# EAGLE design PCB-DISPLAYDOGM2 (EAGLE 7.7.0)

## Sheet 1 of 2
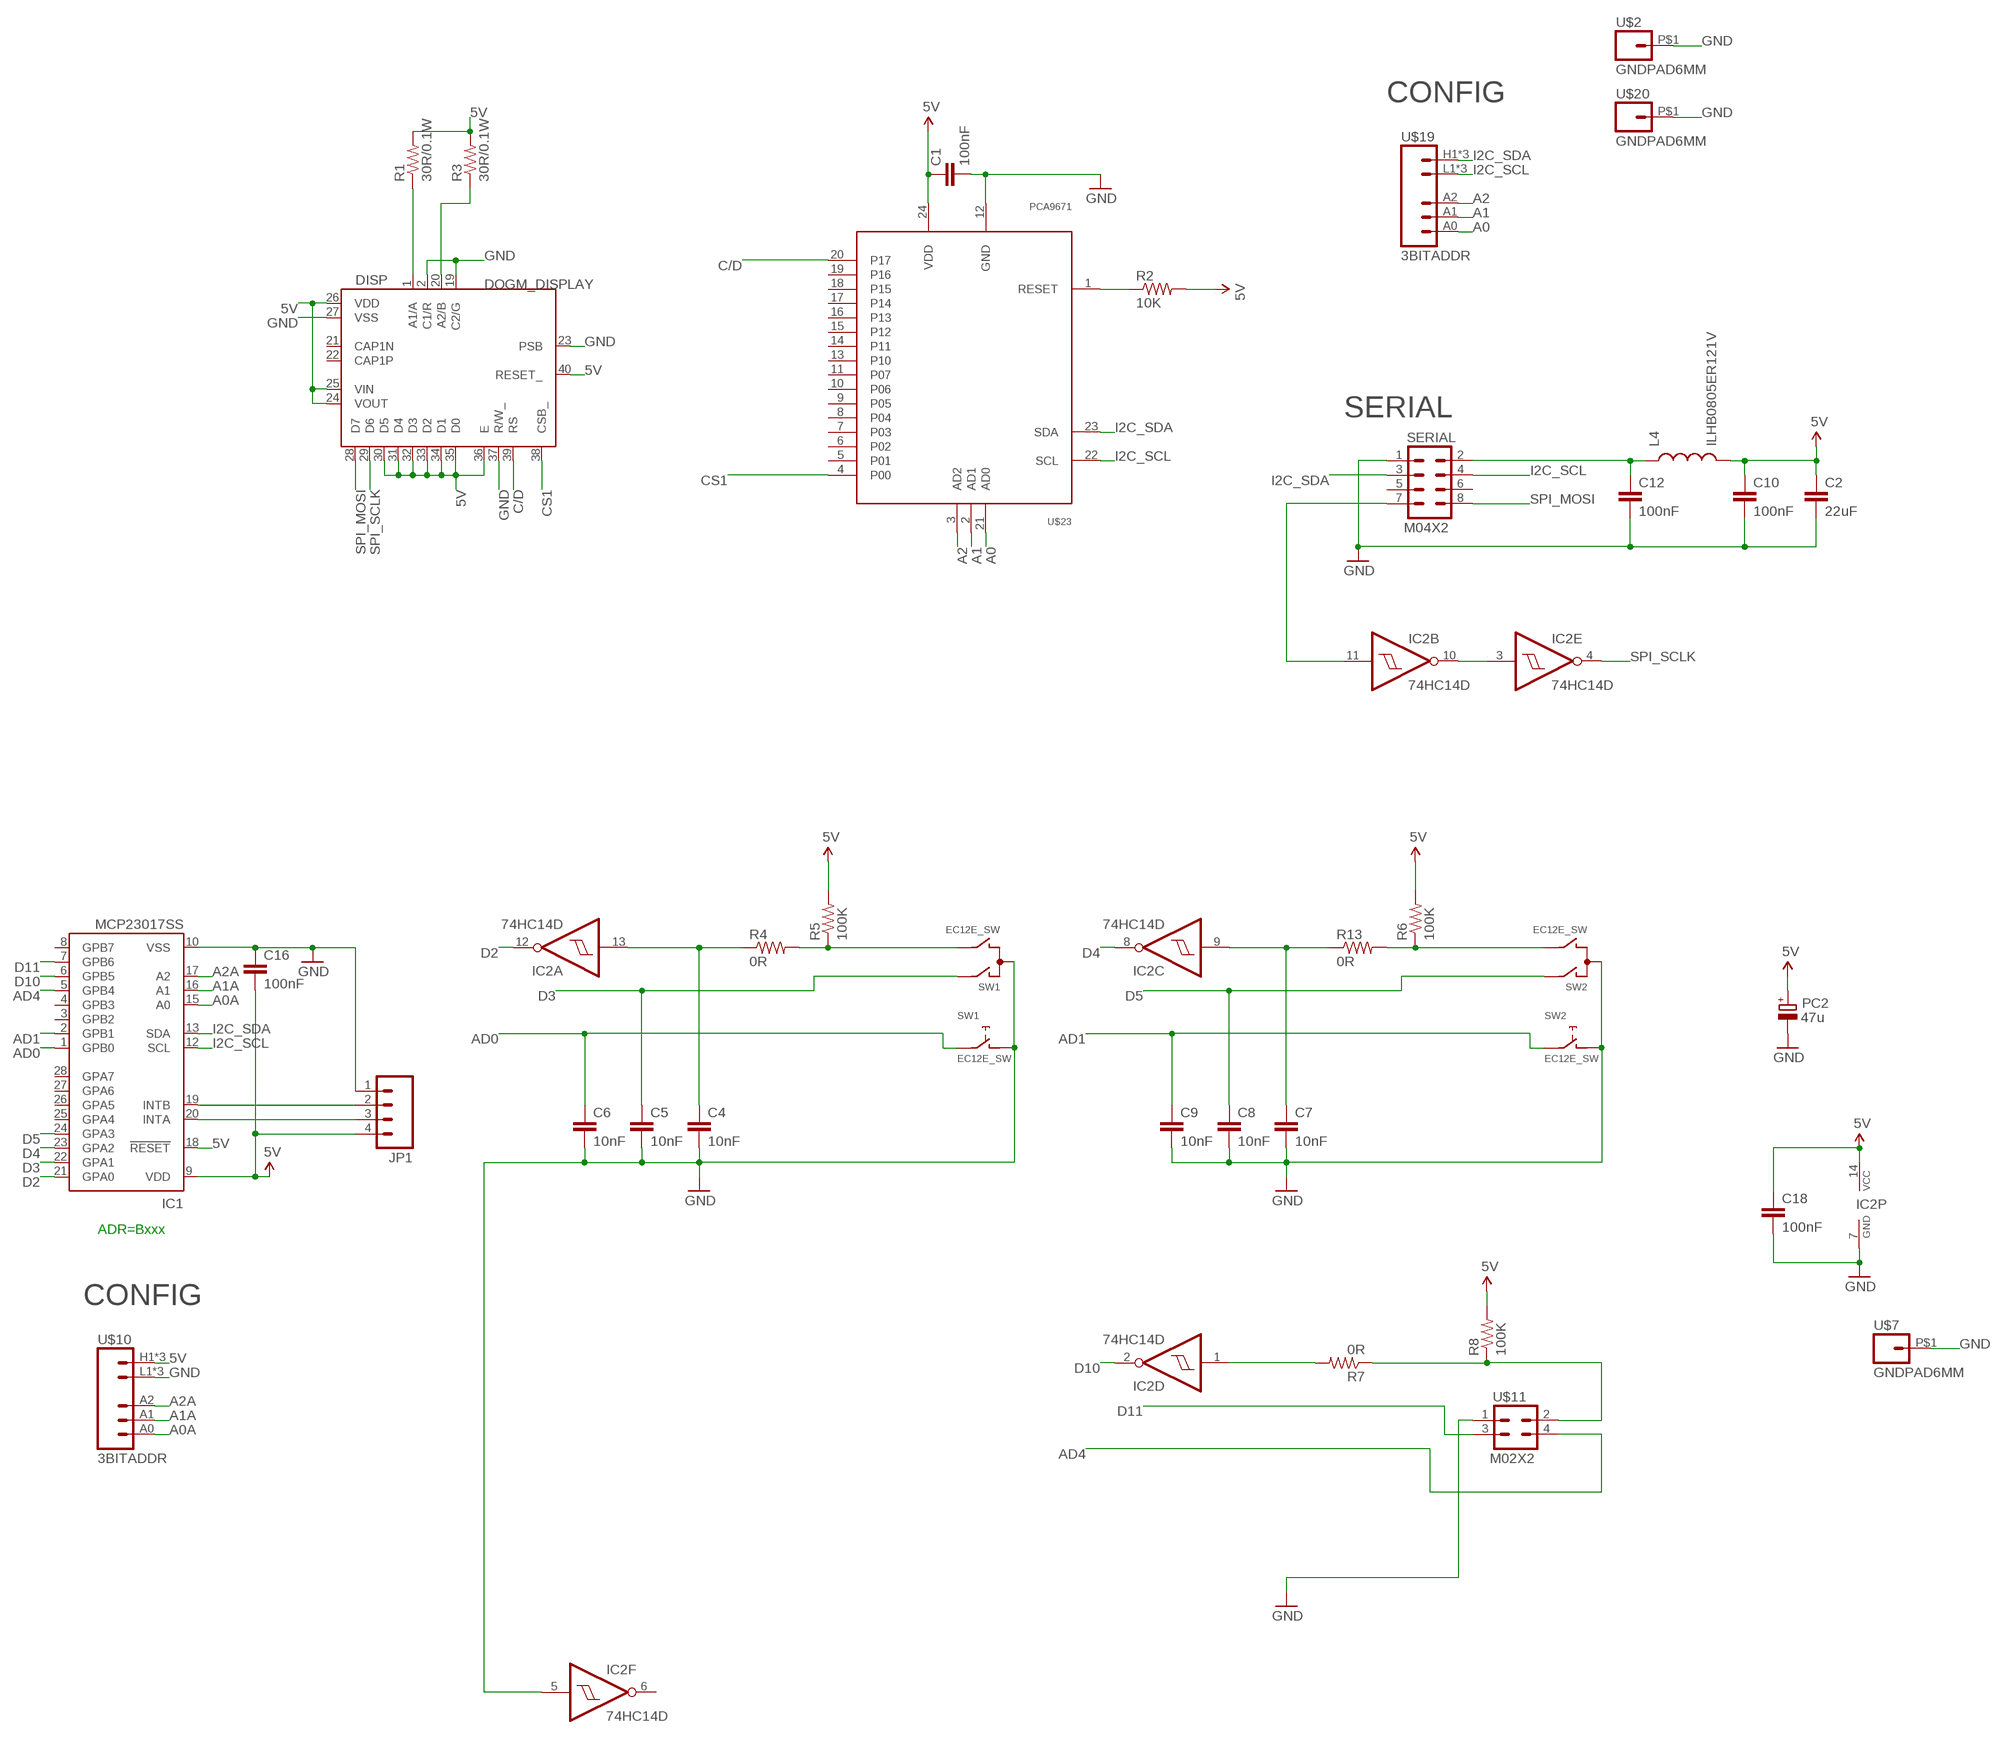
[diagram p0: schematic, sheet 1]

### Parts
C1  100nF  CAP0603-CAP  [0603-CAP]
C2  22uF  CAP0805  [0805]
C4  10nF  CAP0603-CAP  [0603-CAP]
C5  10nF  CAP0603-CAP  [0603-CAP]
C6  10nF  CAP0603-CAP  [0603-CAP]
C7  10nF  CAP0603-CAP  [0603-CAP]
C8  10nF  CAP0603-CAP  [0603-CAP]
C9  10nF  CAP0603-CAP  [0603-CAP]
C10  100nF  CAP0603-CAP  [0603-CAP]
C12  100nF  CAP0603-CAP  [0603-CAP]
C16  100nF  CAP0603-CAP  [0603-CAP]
C18  100nF  CAP0603-CAP  [0603-CAP]
DISP  DOGM_DISPLAY  [DOGM]
IC1  MCP23017SS  [SSOP28]
IC2  74HC14D  [SO14]
JP1  M04PTH  [1X04]
L4  ILHB0805ER121V  INDUCTOR0805  [0805]
PC2  47u  CPOL-EUD  [PANASONIC_D]
R1  30R/0.1W  RESISTOR0603-RES  [0603-RES]
R2  10K  RESISTOR0603-RES  [0603-RES]
R3  30R/0.1W  RESISTOR0603-RES  [0603-RES]
R4  0R  RESISTOR0603-RES  [0603-RES]
R5  100K  RESISTOR0603-RES  [0603-RES]
R6  100K  RESISTOR0603-RES  [0603-RES]
R7  0R  RESISTOR0603-RES  [0603-RES]
R8  100K  RESISTOR0603-RES  [0603-RES]
R13  0R  RESISTOR0603-RES  [0603-RES]
SERIAL  M04X2  [2X4]
SW1  EC12E_SW  [ALPS_EC12E_SW]
SW2  EC12E_SW  [ALPS_EC12E_SW]
U$2  GNDPAD6MM  [3.2MMPAD6MM]
U$7  GNDPAD6MM  [3.2MMPAD6MM]
U$10  3BITADDR  [3BITADDR]
U$11  M02X2  [2X2]
U$19  3BITADDR  [3BITADDR]
U$20  GNDPAD6MM  [3.2MMPAD6MM]
U$23  PCA9671  [TSSOP24]

### Nets
5V [Power]: C1.1 C2.1 C10.1 C16.2 C18.1 DISP.24(VOUT) DISP.25(VIN) DISP.26(VDD) DISP.30(D5) DISP.31(D4) DISP.32(D3) DISP.33(D2) DISP.34(D1) DISP.35(D0) DISP.36(E) DISP.40(RESET_) IC1.9(VDD) IC1.18(!RESET) IC2.14(P:VCC) JP1.4 L4.2 PC2.+ R1.2 R2.2 R3.2 R5.2 R6.2 R8.2 U$10.H1(VCC) U$10.H2(VCC) U$10.H3(VCC) U$23.24(VDD)
A0: U$19.A0 U$23.21(AD0)
A0A: IC1.15(A0) U$10.A0
A1: U$19.A1 U$23.2(AD1)
A1A: IC1.16(A1) U$10.A1
A2: U$19.A2 U$23.3(AD2)
A2A: IC1.17(A2) U$10.A2
AD0: C6.1 IC1.1(GPB0) SW1.E
AD1: C9.1 IC1.2(GPB1) SW2.E
AD4: IC1.5(GPB4) U$11.4
ARD_5V [Power]: C12.1 L4.1 SERIAL.2
C/D: DISP.39(RS) U$23.20(P17)
CS1: DISP.38(CSB_) U$23.4(P00)
D2: IC1.21(GPA0) IC2.12(A:O)
D3: C5.1 IC1.22(GPA1) SW1.A
D4: IC1.23(GPA2) IC2.8(C:O)
D5: C8.1 IC1.24(GPA3) SW2.A
D10: IC1.6(GPB5) IC2.2(D:O)
D11: IC1.7(GPB6) U$11.3
GND [Power]: C1.2 C2.2 C4.2 C5.2 C6.2 C7.2 C8.2 C9.2 C10.2 C12.2 C16.1 C18.2 DISP.2(C1/R) DISP.19(C2/G) DISP.23(PSB) DISP.27(VSS) DISP.37(R/W_) IC1.10(VSS) IC2.5(F:I) IC2.7(P:GND) JP1.1 PC2.- SERIAL.1 SW1.C SW1.D SW2.C SW2.D U$2.P$1 U$7.P$1 U$10.L1(GND) U$10.L2(GND) U$10.L3(GND) U$11.1 U$20.P$1 U$23.12(GND)
I2C_SCL: IC1.12(SCL) SERIAL.4 U$19.L1(GND) U$19.L2(GND) U$19.L3(GND) U$23.22(SCL)
I2C_SDA: IC1.13(SDA) SERIAL.3 U$19.H1(VCC) U$19.H2(VCC) U$19.H3(VCC) U$23.23(SDA)
N$1: R2.1 U$23.1(RESET)
N$2: DISP.1(A1/A) R1.1
N$3: DISP.20(A2/B) R3.1
N$4: R4.2 R5.1 SW1.B
N$5: IC2.1(D:I) R7.2
N$6: R6.1 R13.2 SW2.B
N$7: IC2.3(E:I) IC2.10(B:O)
N$8: IC2.11(B:I) SERIAL.7
N$17: IC1.19(INTB) JP1.2
N$18: IC1.20(INTA) JP1.3
N$124: C4.1 IC2.13(A:I) R4.1
N$125: C7.1 IC2.9(C:I) R13.1
N$127: R7.1 R8.1 U$11.2
SPI_MOSI: DISP.28(D7) SERIAL.8
SPI_SCLK: DISP.29(D6) IC2.4(E:O)
Unconnected: DISP.21(CAP1N) DISP.22(CAP1P) IC1.3(GPB2) IC1.4(GPB3) IC1.8(GPB7) IC1.25(GPA4) IC1.26(GPA5) IC1.27(GPA6) IC1.28(GPA7) IC2.6(F:O) SERIAL.5 SERIAL.6 SW1.GND1(G) SW1.GND2(G) SW2.GND1(G) SW2.GND2(G) U$23.5(P01) U$23.6(P02) U$23.7(P03) U$23.8(P04) U$23.9(P05) U$23.10(P06) U$23.11(P07) U$23.13(P10) U$23.14(P11) U$23.15(P12) U$23.16(P13) U$23.17(P14) U$23.18(P15) U$23.19(P16)

### Notes on the sheet
- CONFIG
- SERIAL
- ADR=Bxxx
- CONFIG

## Sheet 2 of 2

## Library data of the parts
C1 C2 C4-C10 C12 C16 C18 = SparkFun:CAP: Capacitor Standard 0603 ceramic capacitor, and 0.1" leaded capacitor.
DISP = SKAARHOJ:DOGM_DISPLAY
IC1 = microchip:MCP23017: http://ww1.microchip.com/downloads/en/DeviceDoc/21952a.pdf Source: http://ww1.microchip.com/downloads/en/DeviceDoc/21952a.pdf; MF: MICROCHIP; MPN: MCP23017-E/SS; OC_FARNELL: 1467674; OC_NEWARK: 31K2960
IC2 = 74xx-eu:74*14: Hex schmitt trigger INVERTER
JP1 = SparkFun:M04: Header 4 Standard 4-pin 0.1" header. Use with straight break away headers (SKU : PRT-00116), right angle break away headers (PRT-00553), swiss pins (PRT-00743), machine pins (PRT-00117), and female headers (PRT-00115). Molex polarized connector foot print use with SKU : PRT-08231 with associated crimp pins and housings. 1MM SMD Version SKU: PRT-10208
L4 = SparkFun:INDUCTOR: Inductors Basic Inductor/Choke - 0603 and 1206. Footprints are not proven and vary greatly between part numbers.
PC2 = rcl:CPOL-EU: POLARIZED CAPACITOR, European symbol
R1-R8 R13 = SparkFun:RESISTOR: Resistor Basic schematic elements and footprints for 0603, 1206, and PTH resistors.
SERIAL = SparkFun:M04X2
SW1 SW2 = switch-alps:EC12E_SW: ALPS rotary Encoder EC12E series with switch; MPN: EC12E2424407; OC_FARNELL: 1520813; OC_NEWARK: 74M1068
U$2 U$7 U$20 = SKAARHOJ:GNDPAD
U$10 U$19 = SKAARHOJ:3BITADDR
U$11 = SKAARHOJ:M02X2
U$23 = SKAARHOJ:PCA9671

## Net classes
0 default: width 0.203 mm, drill 0.406 mm, clearance 0.203 mm
1 Power: width 0.406 mm, drill 0.61 mm, clearance 0.203 mm
2 BoostPower: width 0.61 mm, drill 0.61 mm, clearance 0.305 mm

## Board
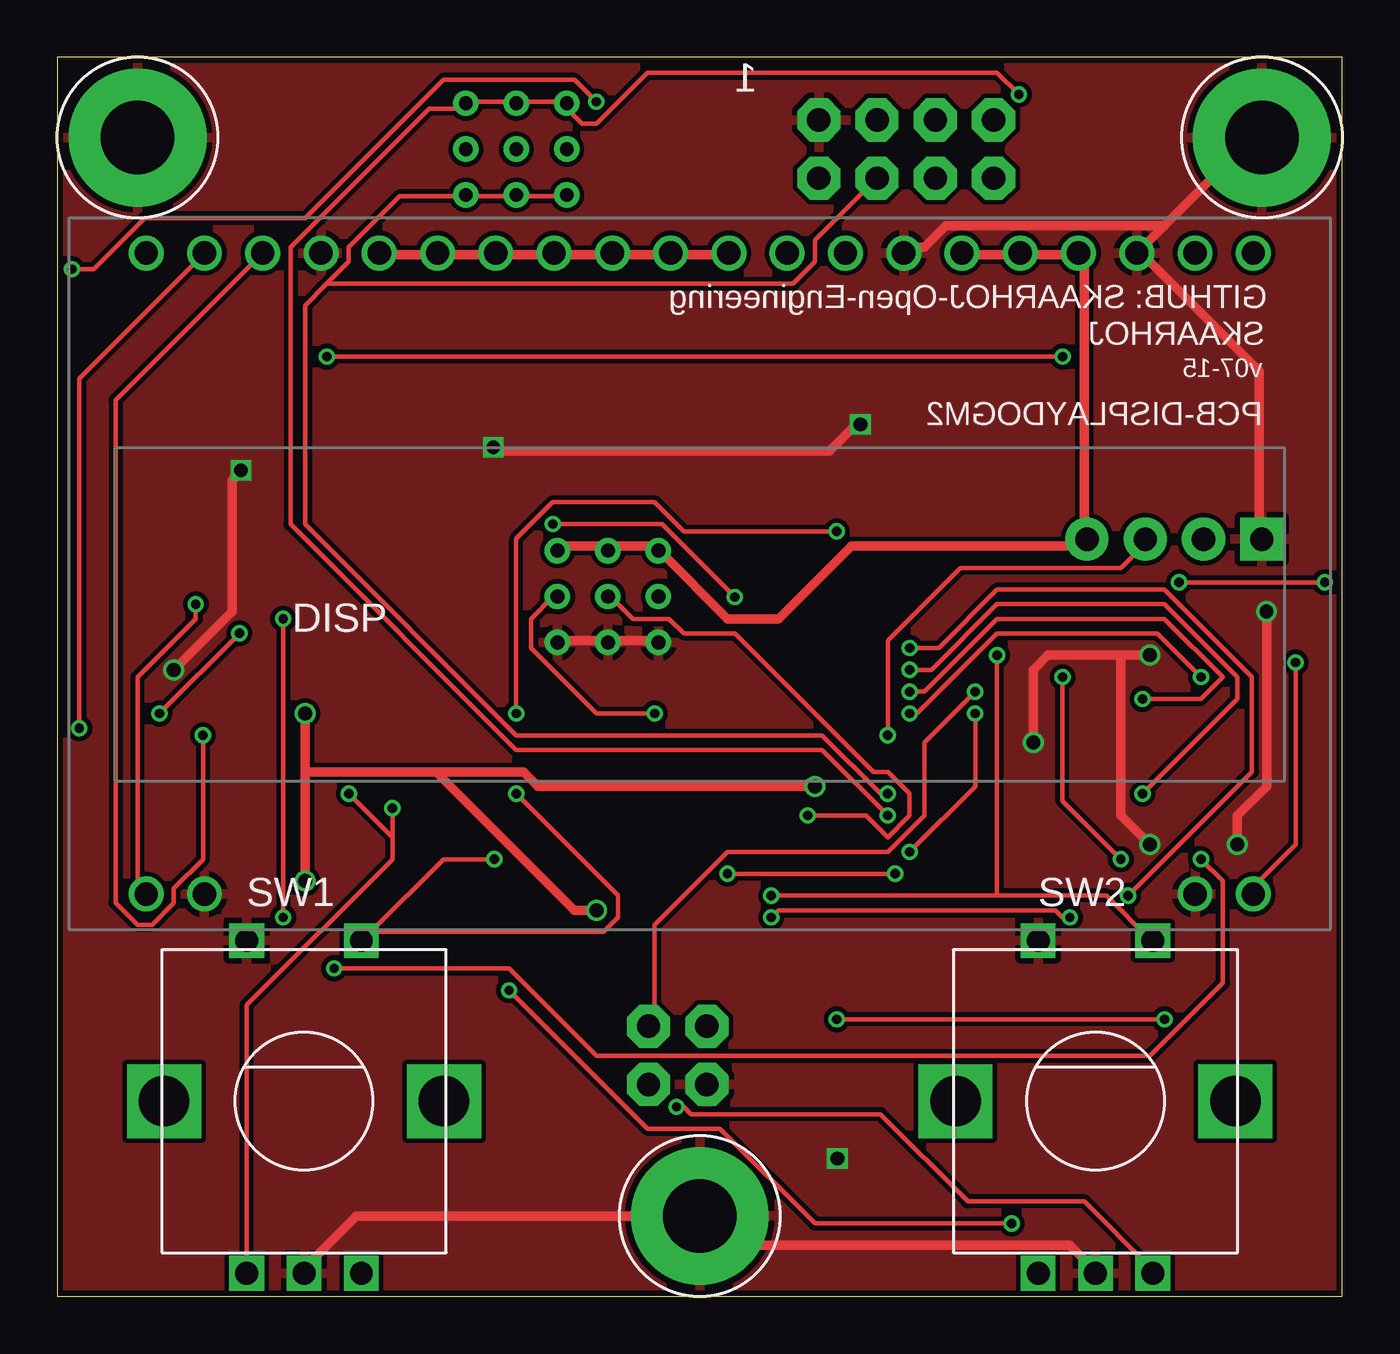
[diagram p1: board, top side]
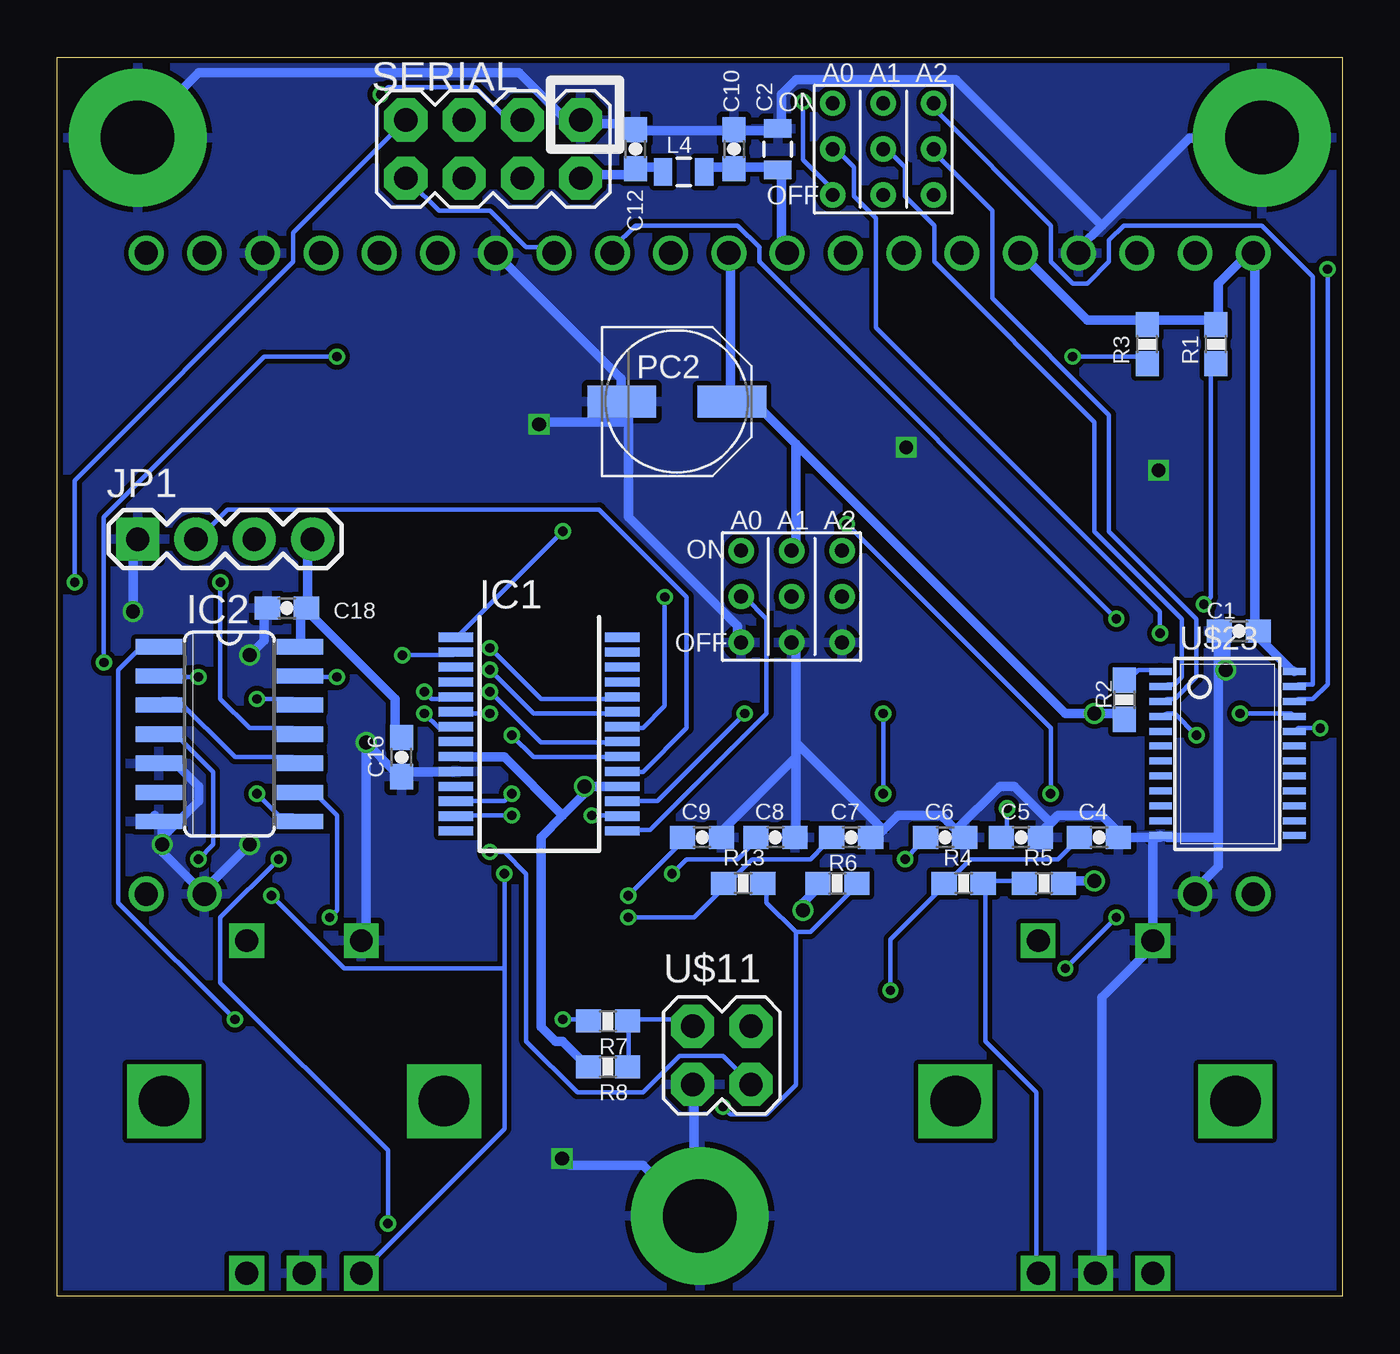
[diagram p2: board, bottom side, seen from below]

Size 56 x 54 mm. Coordinates in mm from the lower left corner, seen from the top.
Outline: 56,0 56,54 0,54 0,0 56,0
Copper layers (1*16): Top 0.035mm / dielectric 1.5mm / Bottom 0.035mm
Design rules "Fusion_eagle_rule_v1.1": minimum track width 6mil, minimum drill 12mil, track to track 6mil, track to pad 6mil, pad to pad 6mil, via to via 6mil, smd to smd 0mil, copper to edge 10mil, drill to drill 10mil, minimum pad ring 10mil, minimum via ring 6mil, stop-mask expansion 2mil, vias tented up to drill 100mil, thermal gap 10mil

### Footprints (pad centres in the part's own frame; a part is rotated, then mirrored left to right if it is on the bottom)
0603-CAP = smd 1.1 x 1: 1 -0.85,0; 2 0.85,0
0805 = smd 0.8 x 1.2: 1 -0.9,0; 2 0.9,0
DOGM = drill 1.016: 1 -24.13,-12.19; 2 -21.59,-12.19; 19 21.59,-12.19; 20 24.13,-12.19; 21 24.13,15.75; 22 21.59,15.75; 23 19.05,15.75; 24 16.51,15.75; 25 13.97,15.75; 26 11.43,15.75; 27 8.89,15.75; 28 6.35,15.75; 29 3.81,15.75; 30 1.27,15.75; 31 -1.27,15.75; 32 -3.81,15.75; 33 -6.35,15.75; 34 -8.89,15.75; 35 -11.43,15.75; 36 -13.97,15.75; 37 -16.51,15.75; 38 -19.05,15.75; 39 -21.59,15.75; 40 -24.13,15.75
SSOP28 = smd 0.4 x 1.5: 1 -4.225,-3.625; 2 -3.575,-3.625; 3 -2.925,-3.625; 4 -2.275,-3.625; 5 -1.625,-3.625; 6 -0.975,-3.625; 7 -0.325,-3.625; 8 0.325,-3.625; 9 0.975,-3.625; 10 1.625,-3.625; 11 2.275,-3.625; 12 2.925,-3.625; 13 3.575,-3.625; 14 4.225,-3.625; 15 4.225,3.625; 16 3.575,3.625; 17 2.925,3.625; 18 2.275,3.625; 19 1.625,3.625; 20 0.975,3.625; 21 0.325,3.625; 22 -0.325,3.625; 23 -0.975,3.625; 24 -1.625,3.625; 25 -2.275,3.625; 26 -2.925,3.625; 27 -3.575,3.625; 28 -4.225,3.625
SO14 = smd 0.66 x 2.032: 1 -3.81,-3.073; 2 -2.54,-3.073; 3 -1.27,-3.073; 4 0,-3.073; 5 1.27,-3.073; 6 2.54,-3.073; 7 3.81,-3.073; 8 3.81,3.073; 9 2.54,3.073; 10 1.27,3.073; 11 0,3.073; 12 -1.27,3.073; 13 -2.54,3.073; 14 -3.81,3.073
1X04 = drill 1.016 pad 1.88 square: 1 0,0 | drill 1.016 pad 1.88: 2 2.54,0; 3 5.08,0; 4 7.62,0
PANASONIC_D = smd 3 x 1.4: + 2.4,0; - -2.4,0
0603-RES = smd 1.1 x 1: 1 -0.85,0; 2 0.85,0
2X4 = drill 1.016 pad 1.88 octagon: 1 -3.81,-1.27; 2 -3.81,1.27; 3 -1.27,-1.27; 4 -1.27,1.27; 5 1.27,-1.27; 6 1.27,1.27; 7 3.81,-1.27; 8 3.81,1.27
ALPS_EC12E_SW = drill 1 square: A -2.5,-7.5; B 2.5,-7.5; C 0,-7.5; D -2.5,7; E 2.5,7 | drill 2.2 square: GND1 -6.1,0; GND2 6.1,0
3.2MMPAD6MM = drill 3.2 pad 6: P$1 0,0
3BITADDR = drill 0.6: A0 -2.2,0; A1 0,0; A2 2.2,0; H1 -2.2,2; H2 0,2; H3 2.2,2; L1 -2.2,-2; L2 0,-2; L3 2.2,-2
2X2 = drill 1.016 pad 1.88 octagon: 1 -3.81,-1.27; 2 -3.81,1.27; 3 -1.27,-1.27; 4 -1.27,1.27
TSSOP24 = smd 0.305 x 0.991: 1 -4.225,-2.918; 2 -3.575,-2.918; 3 -2.925,-2.918; 4 -2.275,-2.918; 5 -1.625,-2.918; 6 -0.975,-2.918; 7 -0.325,-2.918; 8 0.325,-2.918; 9 0.975,-2.918; 10 1.625,-2.918; 11 2.275,-2.918; 12 2.925,-2.918; 13 2.925,2.918; 14 2.275,2.918; 15 1.625,2.918; 16 0.975,2.918; 17 0.325,2.918; 18 -0.325,2.918; 19 -0.975,2.918; 20 -1.625,2.918; 21 -2.275,2.918; 22 -2.925,2.918; 23 -3.575,2.918; 24 -4.225,2.918

### Placement (x,y rotation side)
C1  4.5,29 180 bottom
C2  24.6,50 90 bottom
C4  10.6,20 0 bottom
C5  14,20 0 bottom
C6  17.3,20 0 bottom
C7  21.4,20 0 bottom
C8  24.7,20 0 bottom
C9  27.9,20 0 bottom
C10  26.5,50 90 bottom
C12  30.8,50 90 bottom
C16  41,23.5 90 bottom
C18  46,30 180 bottom
DISP  28,29.72 0 top
IC1  35,24.5 270 bottom
IC2  48.5,24.5 270 bottom
JP1  52.5,33 0 bottom
L4  28.7,49 0 bottom
PC2  29,39 0 bottom
R1  5.5,41.5 90 bottom
R2  9.5,26 270 bottom
R3  8.5,41.5 90 bottom
R4  16.5,18 0 bottom
R5  13,18 0 bottom
R6  22,18 180 bottom
R7  32,12 180 bottom
R8  32,10 180 bottom
R13  26.1,18 0 bottom
SERIAL  37,50 180 bottom
SW1  10.75,8.5 0 top
SW2  45.25,8.5 0 top
U$2  28,3.5 0 top
U$7  52.5,50.5 0 top
U$10  24,30.5 0 bottom
U$11  24.5,10.5 0 bottom
U$19  20,50 0 bottom
U$20  3.5,50.5 0 top
U$23  5,23 270 bottom

### Tracks (layer width: path | path; a pad name or v marks a point on that pad's centre or on a via)
5V  (via drill 0.61)
  Top 0.406: DISP.26 39.69,45.4 41.91,45.4 DISP.25 42.23,45.4 44.45,45.4 DISP.24 44.77,45.4 44.77,33.02 JP1.4 44.77,32.7 34.61,32.7 31.43,29.53 29.21,29.53 26.35,32.38 U$10.H1 26.04,32.7 24.13,32.7 U$10.H2 23.81,32.7 21.91,32.7 U$10.H3 | DISP.30 29.21,45.4 26.99,45.4 DISP.31 26.67,45.4 24.45,45.4 DISP.32 24.13,45.4 21.91,45.4 DISP.33 21.59,45.4 19.37,45.4 DISP.34 19.05,45.4 16.83,45.4 DISP.35 16.51,45.4 14.29,45.4 DISP.36 | v10.79,25.4 10.79,22.86 | 10.79,22.86 v10.79,18.1 | v23.5,16.83 22.54,16.83 16.51,22.86 | 10.79,22.86 16.51,22.86 | v33.02,22.23 20.95,22.23 20.32,22.86 16.51,22.86
  Bottom 0.406: C16.2 41.27,24.45 41.27,26.04 45.09,29.84 C18.1 | IC2.14 45.4,28.57 45.4,29.84 C18.1 | JP1.4 45.09,32.7 45.09,30.16 C18.1 | U$23.24 2.22,27.3 3.81,28.89 C1.1 3.81,29.21 3.81,45.4 DISP.40 4.13,45.4 5.4,44.13 5.4,42.55 R1.2 5.71,42.55 8.26,42.55 R3.2 8.57,42.55 11.11,42.55 13.97,45.4 DISP.36 | L4.2 27.62,49.21 26.67,49.21 C10.1 26.35,49.21 24.77,49.21 C2.1 24.45,48.9 24.45,45.72 DISP.32 | 33.02,21.91 32.7,22.23 IC1.18 | 33.02,21.91 33.97,20.95 | 33.97,20.95 34.92,20 34.92,11.75 34.29,11.11 33.97,11.11 33.02,10.16 R8.2 | 33.97,20.95 36.51,23.5 38.42,23.5 IC1.9 | 23.81,37.15 25.4,38.73 26.35,38.73 PC2.+ 26.67,39.05 26.67,45.4 DISP.31 | 23.81,37.15 12.06,25.4 v10.79,25.4 9.53,25.4 R2.2 | v10.79,18.1 12.06,18.1 R5.2 | v23.5,16.83 23.5,17.14 22.86,17.78 R6.2 | 23.81,37.15 23.81,32.7 U$10.H2 | v33.02,22.23 33.02,21.91
A0  (via drill 0.41)
  Top 0.203: v7.94,28.89 v4.45,25.4
  Bottom 0.203: v4.45,25.4 2.22,25.4 U$23.21 | v7.94,28.89 7.94,29.84 20.32,42.23 20.32,46.99 21.27,47.94 21.27,49.21 21.91,49.85 U$19.A0
A0A
  Bottom 0.203: IC1.15 31.11,20.32 30.16,20.32 25.08,25.4 25.08,29.53 26.04,30.48 U$10.A0
A1
  Bottom 0.203: U$23.2 7.62,26.67 7.3,26.67 6.99,26.99 6.99,29.53 10.79,33.34 10.79,38.1 17.78,45.09 17.78,46.67 19.05,47.94 19.05,49.21 19.68,49.85 U$19.A1
A1A  (via drill 0.41)
  Top 0.203: v32.7,20.95 35.24,20.95 36.2,20 37.15,20.95 37.15,21.91 36.2,22.86 35.56,22.86 29.53,28.89 27.3,28.89 26.67,29.53 25.08,29.53 24.13,30.48 U$10.A1
  Bottom 0.203: v32.7,20.95 31.43,20.95 IC1.16
A2
  Bottom 0.203: U$23.3 7.62,26.04 7.3,26.04 6.35,26.99 6.35,29.53 10.16,33.34 10.16,38.42 15.24,43.5 15.24,47.31 17.78,49.85 U$19.A2
A2A  (via drill 0.41)
  Top 0.203: v26.04,25.4 23.5,25.4 20.64,28.26 20.64,29.53 21.59,30.48 U$10.A2
  Bottom 0.203: v26.04,25.4 29.84,21.59 31.11,21.59 IC1.17
AD0  (via drill 0.41)
  Top 0.203: v19.05,19.05 16.83,19.05 13.65,15.88 | 13.65,15.88 13.34,15.56 SW1.E 13.65,15.88 | v33.97,33.34 27.3,33.34 26.04,34.61 21.59,34.61 20,33.02 v20,25.4 | v20,21.91 24.45,17.46 24.45,16.51 23.81,15.88 13.65,15.88
  Bottom 0.203: v19.05,19.05 18.41,19.68 C6.1 | v33.97,33.34 38.42,28.89 IC1.1 | v20,21.91 v20,25.4
AD1  (via drill 0.41)
  Top 0.203: 40.96,17.46 45.72,17.46 47.62,15.56 SW2.E | 40.96,17.46 v31.11,17.46 | 40.96,17.46 v40.96,27.94
  Bottom 0.203: v31.11,17.46 28.89,19.68 C9.1 | v40.96,27.94 38.73,27.94 IC1.2
AD4  (via drill 0.41)
  Top 0.203: v40.01,26.35 37.78,24.13 37.78,20.95 36.2,19.37 29.21,19.37 26.04,16.19 26.04,12.06 U$11.4
  Bottom 0.203: v40.01,26.35 39.69,26.04 38.73,26.04 IC1.5
ARD_5V
  Bottom 0.406: L4.1 29.84,49.21 30.8,49.21 C12.1 31.11,48.9 33.02,48.9 SERIAL.2
C/D  (via drill 0.41)
  Top 0.203: v0.95,24.77 0.95,40.01 6.35,45.4 DISP.39
  Bottom 0.203: v0.95,24.77 1.91,24.77 U$23.20
CS1  (via drill 0.41)
  Top 0.203: v6.35,24.45 6.35,19.05 5.08,17.78 5.08,17.14 4.13,16.19 3.49,16.19 2.54,17.14 2.54,39.05 8.89,45.4 DISP.38
  Bottom 0.203: v6.35,24.45 7.3,25.4 7.62,25.4 U$23.4
D2  (via drill 0.41)
  Top 0.203: v37.15,26.35 37.78,26.35 40.96,29.53 48.26,29.53 50.8,26.99 49.85,26.04 v47.31,26.04
  Bottom 0.203: v37.15,26.35 34.92,24.13 31.43,24.13 IC1.21 | v47.31,26.04 45.72,26.04 IC2.12
D3  (via drill 0.41)
  Top 0.203: 14.61,20 14.61,19.05 8.26,12.7 8.26,1.27 SW1.A | 14.61,20 v14.61,21.27 | v29.53,30.48 26.35,33.66 v21.59,33.66 | 14.61,20 v12.7,21.91
  Bottom 0.203: v14.61,21.27 14.61,20 C5.1 | v29.53,30.48 29.53,25.72 30.48,24.77 31.11,24.77 IC1.22 | v21.59,33.66 12.7,24.77 v12.7,21.91
D4  (via drill 0.41)
  Top 0.203: v37.15,27.3 38.1,27.3 40.96,30.16 48.26,30.16 51.44,26.99 51.44,26.04 v47.31,21.91
  Bottom 0.203: v37.15,27.3 35.24,25.4 31.43,25.4 IC1.23 | v47.31,21.91 46.35,20.95 45.72,20.95 IC2.8
D5  (via drill 0.41)
  Top 0.203: v36.51,18.41 v29.21,18.41 | v37.15,28.26 38.42,28.26 40.96,30.8 48.26,30.8 52.07,26.99 52.07,22.86 v46.67,17.46
  Bottom 0.203: v29.21,18.41 28.57,19.05 26.35,19.05 25.72,19.68 C8.1 | 36.51,14.29 36.51,7.3 42.55,1.27 SW2.A | 36.51,14.29 v36.51,18.41 | v37.15,28.26 34.92,26.04 31.43,26.04 IC1.24 | v46.67,17.46 43.5,14.29 36.51,14.29
D10  (via drill 0.41)
  Top 0.203: v37.15,25.4 37.47,25.4 40.96,28.89 47.94,28.89 v49.85,26.99
  Bottom 0.203: v37.15,25.4 38.42,25.4 IC1.6 | v49.85,26.99 51.44,26.99 IC2.2
D11  (via drill 0.41)
  Top 0.203: v40.01,25.4 40.01,22.23 v37.15,19.37
  Bottom 0.203: v40.01,25.4 39.37,24.77 38.73,24.77 IC1.7 | v37.15,19.37 36.51,19.37 35.56,18.41 35.56,11.11 33.34,8.89 30.48,8.89 28.89,10.48 26.99,10.48 26.04,9.53 U$11.3
GND  (via drill 0.6, 0.61)
  Top 0.406: SW2.C 45.09,1.27 44.13,2.22 29.53,2.22 28.26,3.49 U$2.P$1 27.94,3.49 13.02,3.49 10.79,1.27 SW1.C | U$10.L3 21.91,28.57 23.81,28.57 U$10.L2 24.13,28.57 26.04,28.57 U$10.L1 | 48.26,46.67 52.39,50.8 U$7.P$1 | 48.26,46.67 47.31,45.72 DISP.23 47.31,45.4 52.39,40.32 52.39,33.02 JP1.1 | 48.26,46.67 38.73,46.67 37.78,45.72 37.15,45.72 DISP.27 | 46.35,27.94 43.18,27.94 42.55,27.3 v42.55,24.13 | 46.35,27.94 v47.62,27.94 | v47.62,19.68 46.35,20.95 46.35,27.94 | v19,37 19.05,36.83 33.66,36.83 34.92,38.1 v35,38 | v5.08,27.3 7.62,29.84 7.62,35.56 v8,36 | v51.44,19.68 51.44,20.95 52.7,22.23 v52.7,29.84
  Bottom 0.406: U$11.1 28.26,9.21 28.26,3.81 U$2.P$1 | 16.83,20.32 17.46,20.95 19.37,20.95 20,20.32 | 16.83,20.32 16.51,20 C6.2 16.83,20.32 | 20,20.32 20.32,20 C7.2 20,20.32 | 23.81,24.13 23.81,28.26 U$10.L2 | 23.81,24.13 23.81,23.5 | 23.81,23.5 23.81,20 C8.2 | 23.81,23.5 26.99,20.32 26.99,20 C9.2 | 23.81,24.13 20,20.32 | 9.53,20 8.26,20 | 8.26,20 7.94,20 U$23.12 | 12.7,20.64 12.38,20.95 10.48,20.95 9.53,20 | 12.7,20.64 13.02,20.32 13.02,20 C5.2 | 9.53,20 C4.2 | 5.4,20 5.4,18.73 6.35,17.78 DISP.2 | 5.4,20 5.4,28.89 C1.2 5.08,28.57 v5.08,27.3 | 5.4,20 7.62,20 U$23.12 | 8.26,20 8.26,15.56 SW1.D 8.26,15.24 10.48,13.02 10.48,1.27 SW1.C | 8.26,20 U$23.12 | 16.83,20.32 14.92,22.23 14.29,22.23 12.7,20.64 | 10.48,46.67 6.67,50.48 3.81,50.48 U$20.P$1 | 10.48,46.67 11.43,45.72 DISP.37 | 10.48,46.67 16.83,53.02 23.81,53.02 24.45,52.39 24.45,51.12 C2.2 24.77,50.8 26.35,50.8 C10.2 26.67,50.8 30.8,50.8 C12.2 31.11,51.12 33.02,51.12 SERIAL.1 33.34,51.44 33.97,51.44 35.88,53.34 49.85,53.34 52.39,50.8 U$7.P$1 | 51.75,20.95 IC2.7 51.44,20.64 51.44,20 | IC1.10 38.73,22.86 40.96,22.86 C16.1 41.27,22.86 v42.55,24.13 42.55,15.88 SW2.D | DISP.27 36.83,45.4 31.43,40.01 31.43,39.05 PC2.- 31.11,38.73 31.11,38.1 | 31.11,38.1 31.11,33.97 26.35,29.21 26.35,28.57 U$10.L1 | 27.94,3.81 U$2.P$1 | v47.62,27.94 46.99,28.57 46.99,29.84 C18.2 | v47.62,19.68 49.53,17.78 DISP.19 49.85,17.78 51.44,19.37 v51.44,19.68 51.44,20 | v34,6 33.66,5.71 30.48,5.71 28.57,3.81 U$2.P$1 | 31.11,38.1 34.92,38.1 v35,38 | v52.7,29.84 52.7,32.38 JP1.1 | 51.44,20 49.85,21.59 49.85,22.23 50.8,23.18 51.44,23.18 IC2.5
  pour Top: 0,0 56,0 56,54 0,54
  pour Bottom: 0,0 56,0 56,54 0,54
I2C_SCL  (via drill 0.41)
  Top 0.203: v0.64,44.77 1.59,44.77 3.81,46.99 10.79,46.99 16.83,53.02 22.54,53.02 v23.5,52.07 | v36.2,21.91 35.88,21.91 33.34,24.45 20,24.45 10.79,33.66 10.79,43.18 11.75,44.13 | 11.75,44.13 12.7,45.09 12.7,45.72 14.92,47.94 17.78,47.94 U$19.L3 18.1,47.94 19.68,47.94 U$19.L2 20,47.94 21.91,47.94 U$19.L1 | 11.75,44.13 32.07,44.13 33.02,45.09 33.02,46.04 35.56,48.58 SERIAL.4
  Bottom 0.203: v0.64,44.77 0.64,26.67 1.27,26.04 1.91,26.04 U$23.22 | v23.5,52.07 23.5,49.53 22.23,48.26 U$19.L1 | v36.2,21.91 36.51,21.59 38.42,21.59 IC1.12
I2C_SDA  (via drill 0.41)
  Top 0.203: v36.2,20.95 33.34,23.81 20,23.81 10.16,33.66 10.16,45.72 16.19,51.75 17.78,51.75 U$19.H3 18.1,52.07 19.68,52.07 U$19.H2 20,52.07 21.91,52.07 U$19.H1 22.23,51.75 22.86,51.12 23.5,51.12 25.72,53.34 40.96,53.34 v41.91,52.39
  Bottom 0.203: U$23.23 1.91,26.67 1.27,26.67 1.27,44.45 3.49,46.67 9.53,46.67 10.16,46.04 10.16,45.09 11.11,44.13 11.75,44.13 12.7,45.09 12.7,46.67 17.78,51.75 U$19.H3 | v36.2,20.95 38.42,20.95 IC1.13 | v41.91,52.39 41.59,52.7 37.78,52.7 36.51,51.44 35.88,51.44 SERIAL.3
N$1
  Bottom 0.203: U$23.1 7.94,27.3 8.89,27.3 9.21,26.99 R2.1
N$2  (via drill 0.41)
  Top 0.203: v6.03,30.16 6.03,29.53 3.49,26.99 3.49,18.1 3.81,17.78 DISP.1
  Bottom 0.203: v6.03,30.16 5.71,30.48 5.71,40.64 R1.1
N$3  (via drill 0.41)
  Top 0.203: v43.81,40.96 v11.75,40.96 | v53.98,27.62 53.98,19.68 52.07,17.78 DISP.20
  Bottom 0.203: v11.75,40.96 8.57,40.96 R3.1 | v43.81,40.96 46.99,40.96 53.98,33.97 v53.98,27.62
N$4
  Bottom 0.203: R5.1 13.97,18.1 15.56,18.1 R4.2 15.56,17.78 15.56,11.11 13.34,8.89 13.34,1.27 SW1.B
N$5  (via drill 0.41)
  Top 0.203: v48.26,12.06 v33.97,12.06
  Bottom 0.203: v33.97,12.06 33.02,12.06 R7.2 | v48.26,12.06 53.34,17.14 53.34,27.3 52.39,28.26 51.75,28.26 IC2.1
N$6  (via drill 0.41)
  Top 0.203: v26.99,8.26 27.3,8.26 27.62,7.94 35.88,7.94 39.69,4.13 44.77,4.13 47.62,1.27 SW2.B
  Bottom 0.203: 23.81,15.88 23.18,15.88 21.27,17.78 R6.1 | 23.81,15.88 25.08,17.14 25.08,17.78 R13.2 | 23.81,15.88 23.81,9.21 25.08,7.94 26.67,7.94 v26.99,8.26
N$7
  Bottom 0.203: IC2.10 45.72,23.5 48.26,23.5 50.8,26.04 51.44,26.04 IC2.3
N$8  (via drill 0.41)
  Top 0.203: v55.24,31.11 v48.9,31.11
  Bottom 0.203: v48.9,31.11 48.9,26.04 47.62,24.77 45.72,24.77 IC2.11 | v55.24,31.11 55.24,35.56 45.72,45.09 45.72,46.35 41.27,50.8 SERIAL.7
N$17
  Bottom 0.203: IC1.19 31.11,22.86 30.48,22.86 28.57,24.77 28.57,30.48 32.38,34.29 48.58,34.29 49.85,33.02 JP1.2
N$18  (via drill 0.41)
  Top 0.203: v36.2,24.45 36.2,28.57 39.37,31.75 46.35,31.75 47.31,32.7 JP1.3
  Bottom 0.203: v36.2,24.45 35.24,23.5 31.43,23.5 IC1.20
N$124  (via drill 0.41)
  Top 0.203: v43.81,26.99 43.81,21.59 v46.35,19.05 | v41.59,3.17 33.02,3.17 28.89,7.3 25.72,7.3 v19.68,13.34
  Bottom 0.203: C4.1 11.75,19.68 12.38,19.05 16.19,19.05 17.14,18.1 R4.1 17.46,17.78 19.68,15.56 v19.68,13.34 | v43.81,26.99 45.4,26.99 IC2.13 | v46.35,19.05 48.9,16.51 48.9,13.65 41.59,6.35 v41.59,3.17
N$125  (via drill 0.41)
  Top 0.203: v44.13,16.51 43.81,16.51 43.5,16.83 31.43,16.83 v31.11,16.51
  Bottom 0.203: C7.1 22.54,19.68 23.18,19.05 25.72,19.05 26.67,18.1 R13.1 26.99,17.78 28.26,16.51 v31.11,16.51 | v44.13,16.51 43.81,16.83 43.81,20.95 44.77,21.91 45.4,21.91 IC2.9
N$127
  Bottom 0.203: R8.1 31.11,10.16 31.11,11.75 R7.1 31.11,12.06 28.57,12.06 U$11.2
SPI_MOSI
  Bottom 0.203: DISP.28 34.61,45.72 35.56,45.72 37.15,47.31 39.37,47.31 40.64,48.58 SERIAL.8
SPI_SCLK  (via drill 0.41)
  Top 0.203: v49.85,19.05 50.8,18.1 50.8,13.65 47.62,10.48 23.5,10.48 19.68,14.29 v12.06,14.29 | v9.84,29.53 v9.84,16.51
  Bottom 0.203: v49.85,19.05 49.21,19.68 49.21,22.86 50.8,24.45 51.44,24.45 IC2.4 | v9.84,16.51 v12.06,14.29 | v9.84,29.53 25.4,45.09 25.4,45.72 26.35,46.67 30.8,46.67 31.75,45.72 DISP.29

### Text on the board
_tsilk: 1 | GITHUB: SKAARHOJ-Open-Engineering | SKAARHOJ | v07-15 | PCB-DISPLAYDOGM2